# EasyEDA schematic EXI.json
TITLE: Sheet_1; REV: 1.0; Date: 2025-02-01; Sheet: 1/1; Drawn By: marrius9876; Company: Your Company
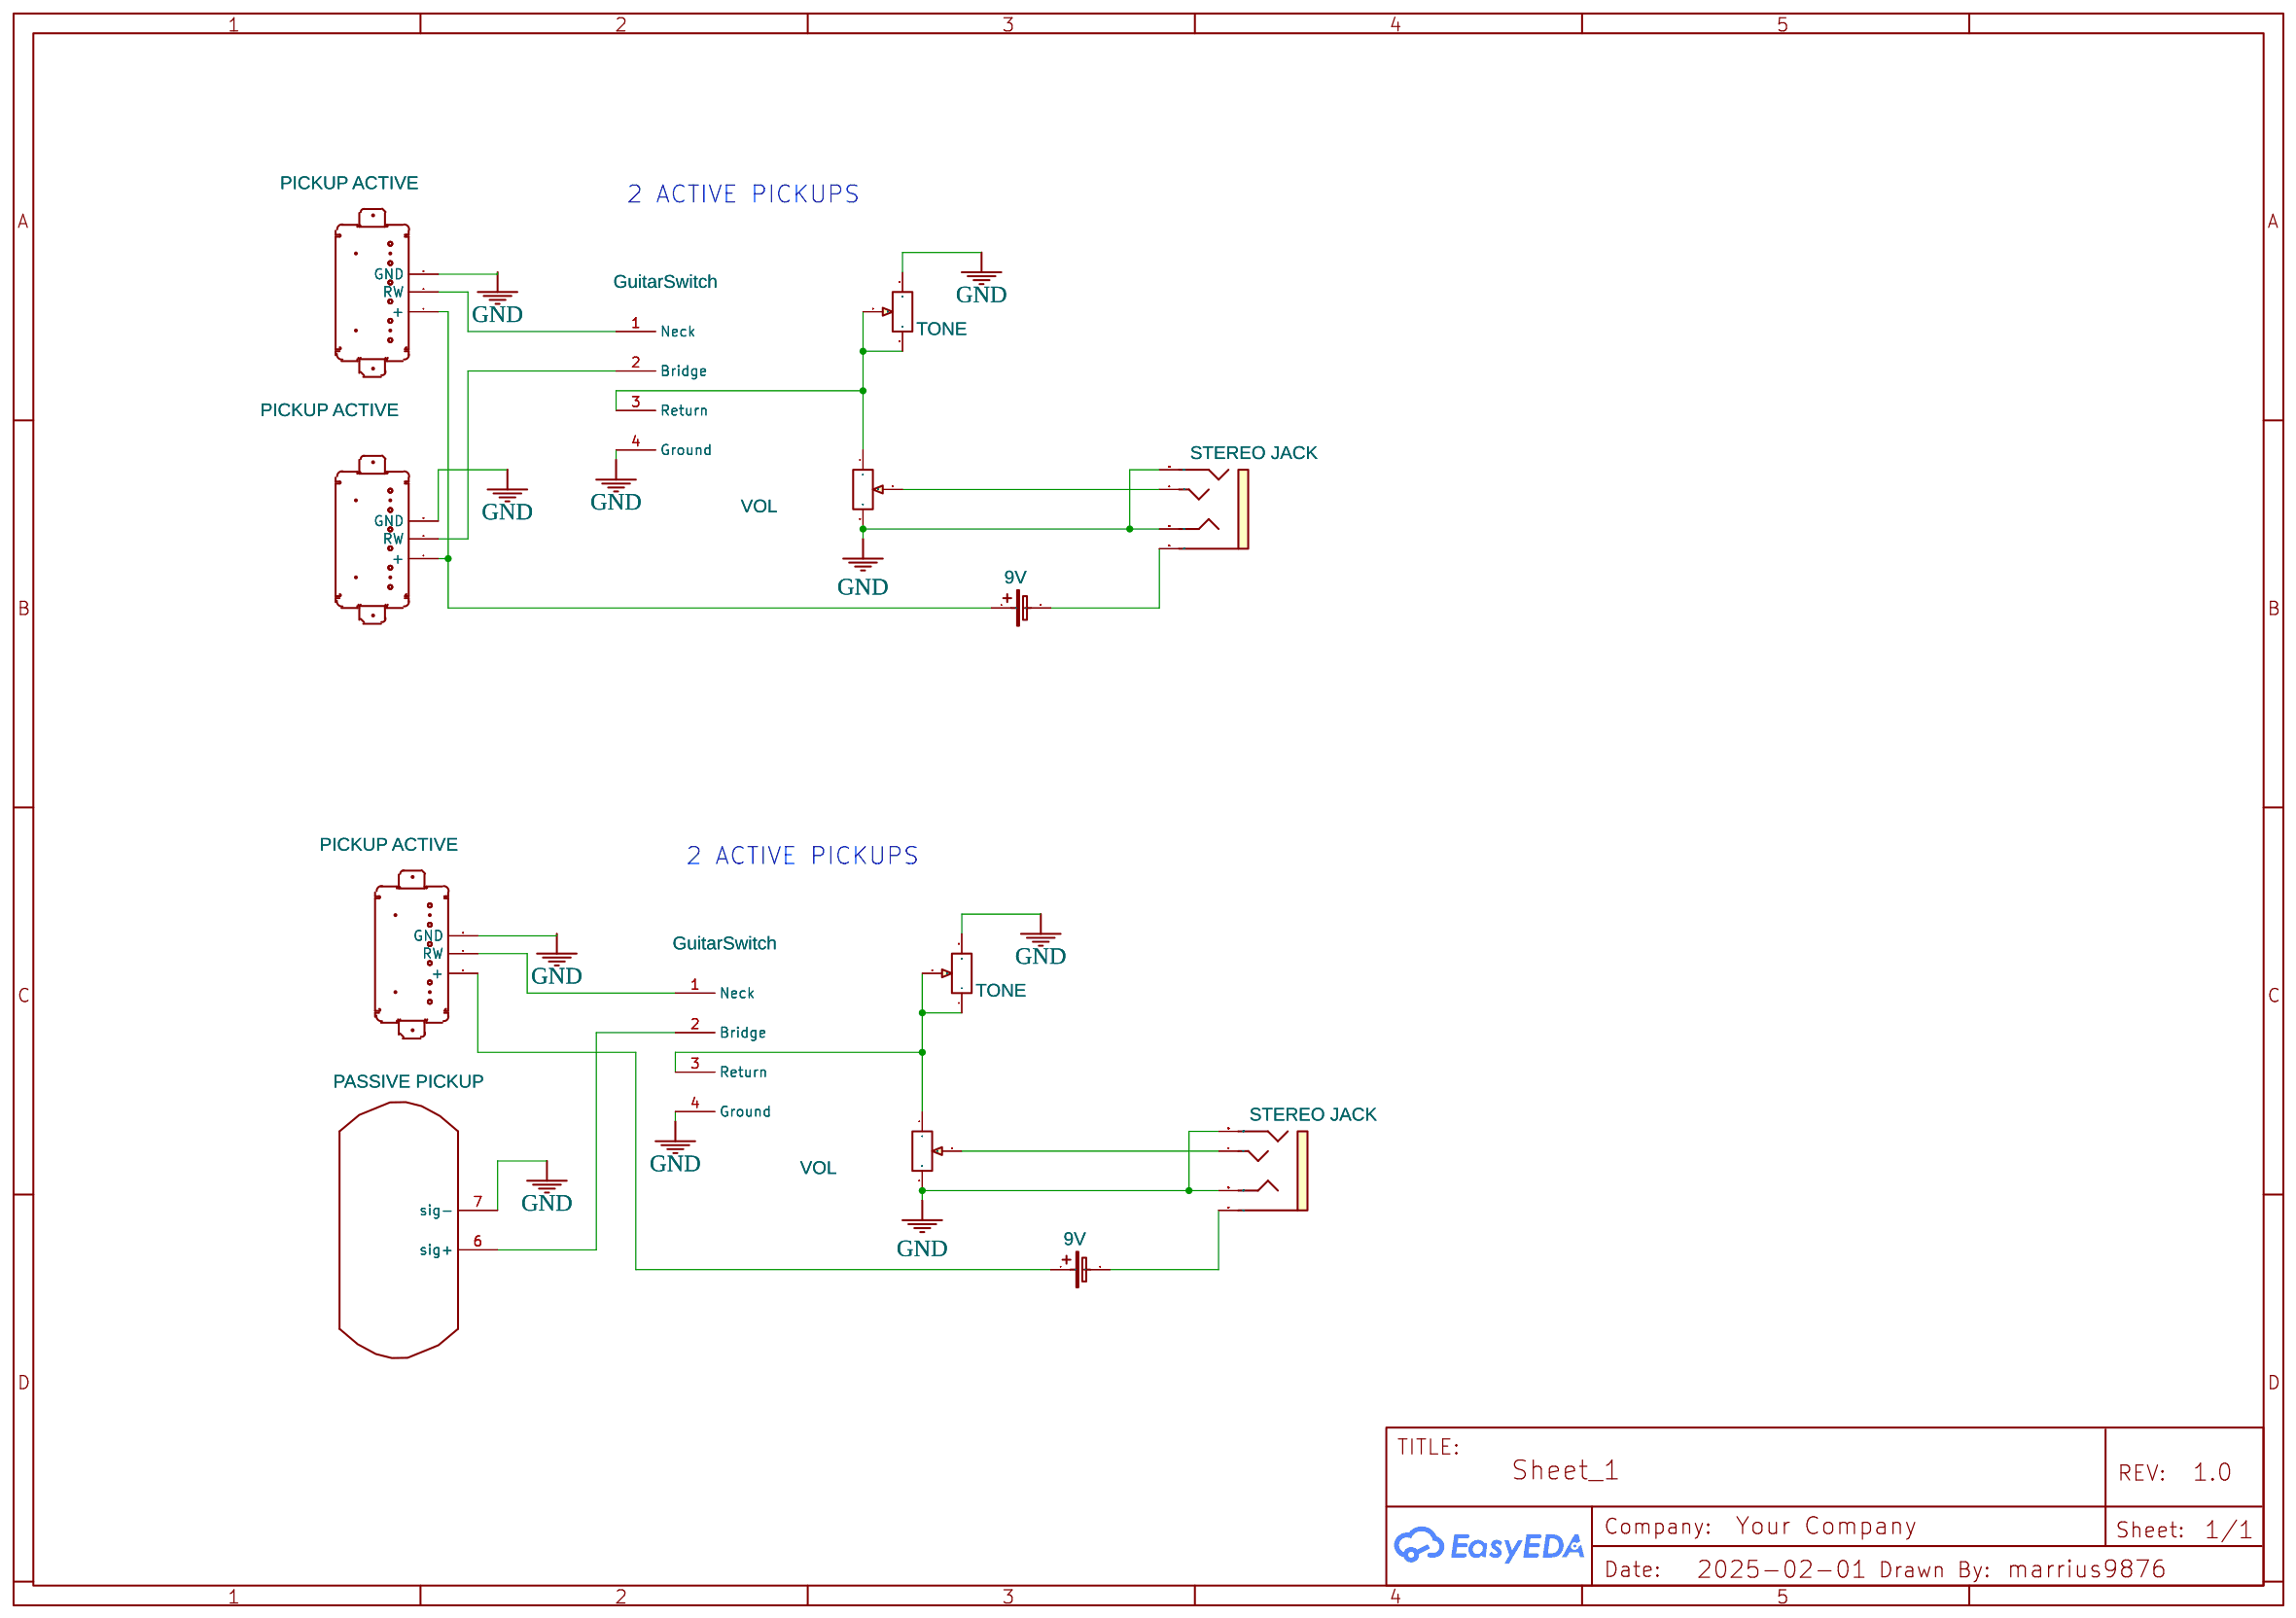
[diagram p0: schematic sheet]

## Parts
BT1  9V  [BATTERY:BATTERYHOLDER_KEYSTONE_1042_1X18650]
BT2  9V  [BATTERY:BATTERYHOLDER_KEYSTONE_1042_1X18650]
RP1  VOL  [RES-ADJ-TH_3386P]
RP2  TONE  [RES-ADJ-TH_3386P]
RP3  TONE  [RES-ADJ-TH_3386P]
RP4  VOL  [RES-ADJ-TH_3386P]
SW1  GuitarSwitch  [GUITARSWITCH]
SW2  GuitarSwitch  [GUITARSWITCH]
U1  PICKUP ACTIVE  [PHOENIX-3P]
U2  PICKUP ACTIVE  [PHOENIX-3P]
U3  STEREO JACK  [AUDIO-JACK-TRRS-SMD]
U4  STEREO JACK  [AUDIO-JACK-TRRS-SMD]
U5  PICKUP ACTIVE  [PHOENIX-3P]
U6  PASSIVE PICKUP  [PICKUP_COIL]

## Library data of the parts
BT1 BT2 = Device_Battery_Cell: Add into BOM: yes; Convert to PCB: yes; Origin Footprint: Battery:BatteryHolder_Keystone_1042_1x18650; Contributor: t.teenoom
RP1-RP4 = R_3386P_EU: Supplier: LCSC; Contributor: LCEDA_Lib; Value(Ω): 10K
SW1 SW2 = GuitarSwitch: Contributor: Jesse Conklin
U1 U2 U5 = Humbucker: Contributor: asaelgm019
U3 U4 = AUDIO-JACK3: Contributor: Oliver Parker
U6 = single_coil: Contributor: thomassegaert

## Nets
GND: RP1.3 RP2.3 RP3.3 RP4.3 SW1.4(Ground) SW2.4(Ground) U1.3(GND) U2.3(GND) U3.RING1 U3.RING2 U4.RING1 U4.RING2 U5.3(GND) U6.7(sig-)
Net-(BT1-1): BT1.1(+) U1.1(+) U2.1(+)
Net-(BT1-2): BT1.2(-) U3.EARTH
Net-(BT2-1): BT2.1(+) U5.1(+)
Net-(BT2-2): BT2.2(-) U4.EARTH
Net-(RP1-1): RP1.1 RP2.1 RP2.2 SW1.3(Return)
Net-(RP1-2): RP1.2 U3.TIP
Net-(RP3-1): RP3.1 RP3.2 RP4.1 SW2.3(Return)
Net-(RP4-2): RP4.2 U4.TIP
Net-(SW1-1): SW1.1(Neck) U2.2(RW)
Net-(SW1-2): SW1.2(Bridge) U1.2(RW)
Net-(SW2-1): SW2.1(Neck) U5.2(RW)
Net-(SW2-2): SW2.2(Bridge) U6.6(sig+)

## Notes on the sheet
- 2 ACTIVE PICKUPS
- 2 ACTIVE PICKUPS
